# EAGLE design Schematic_01 (EAGLE 7.2.0)
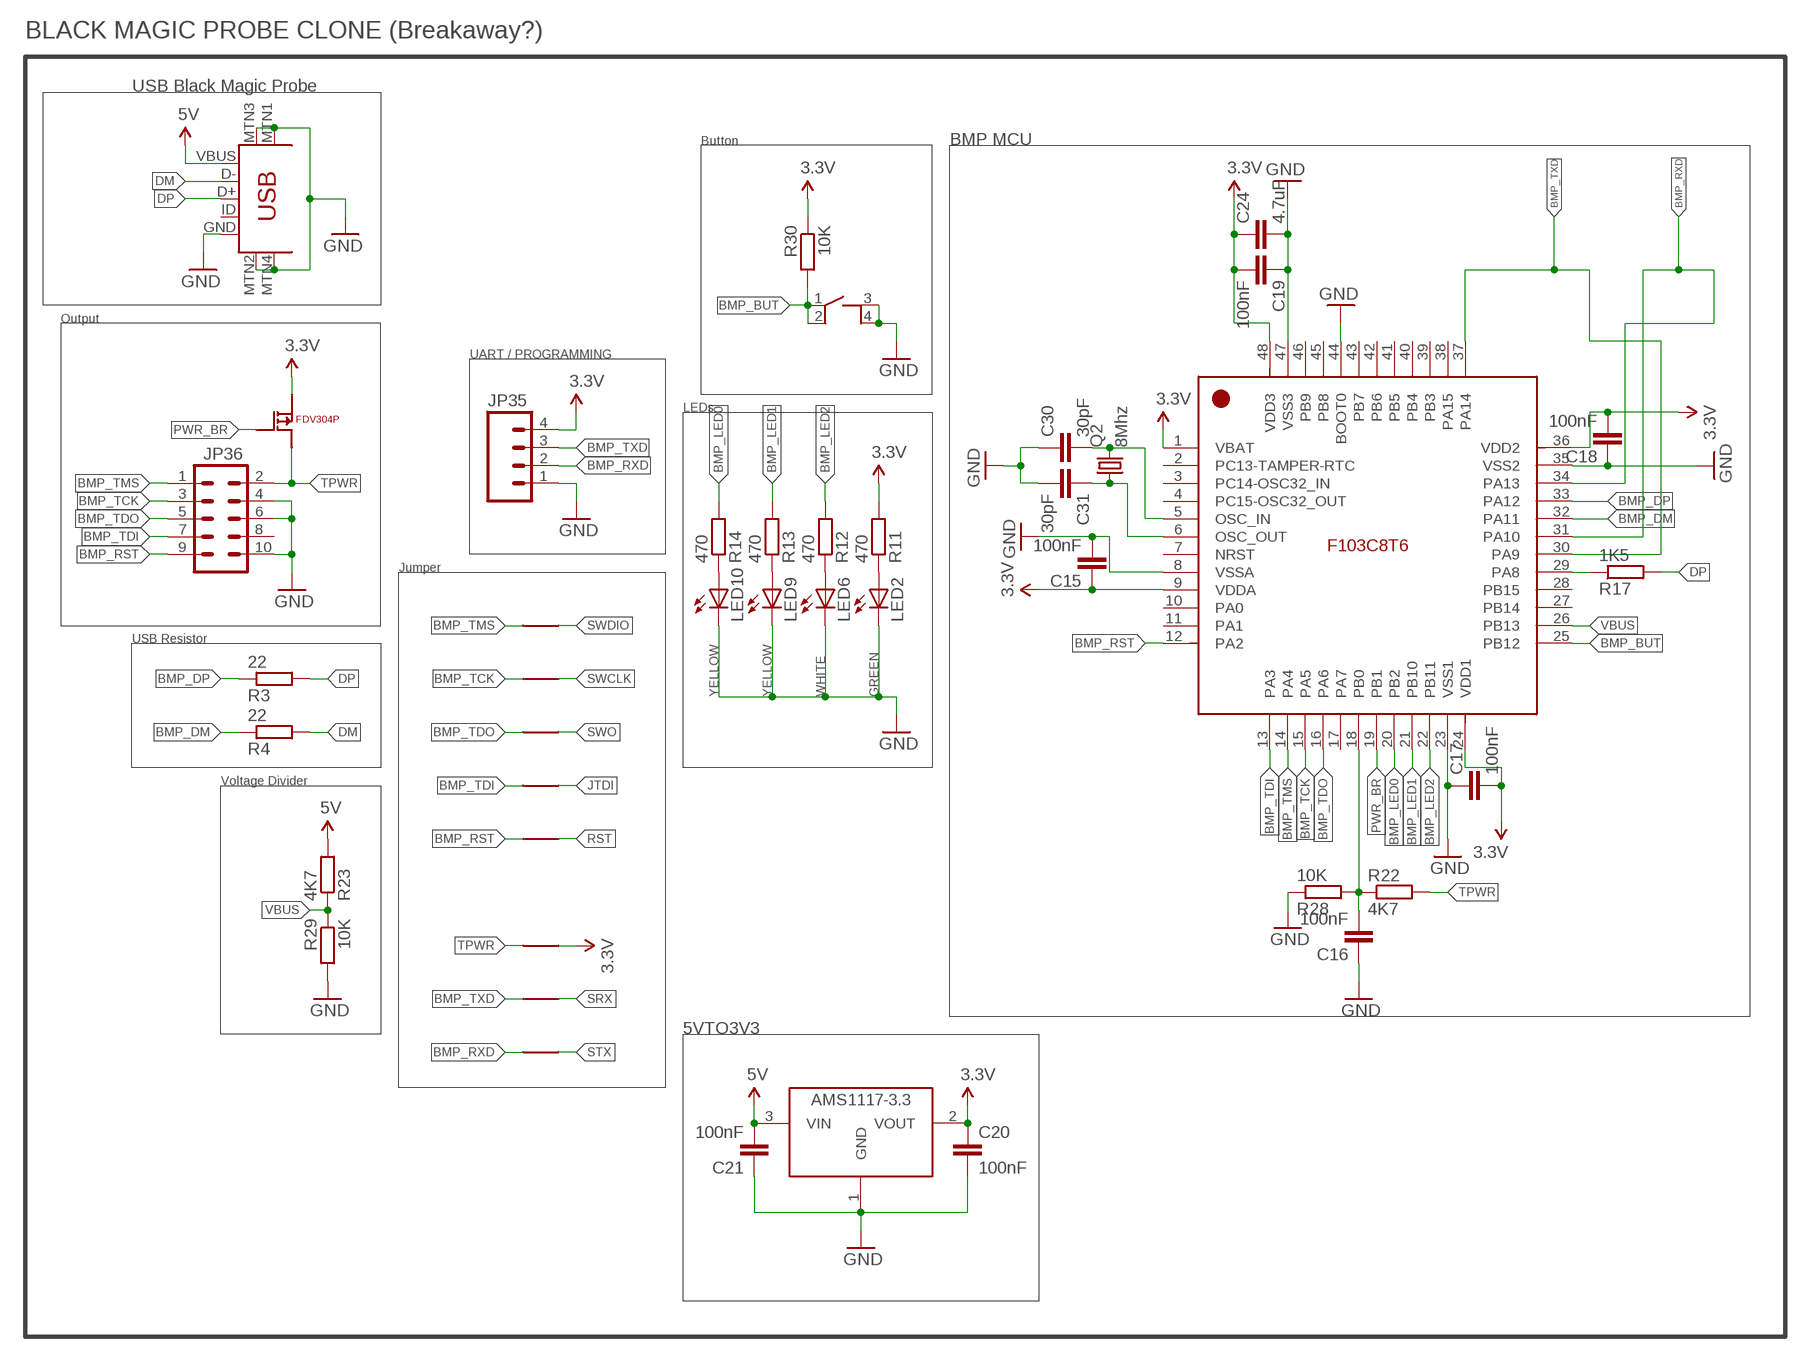
[diagram p0: schematic, sheet 1, part 1 of 2]
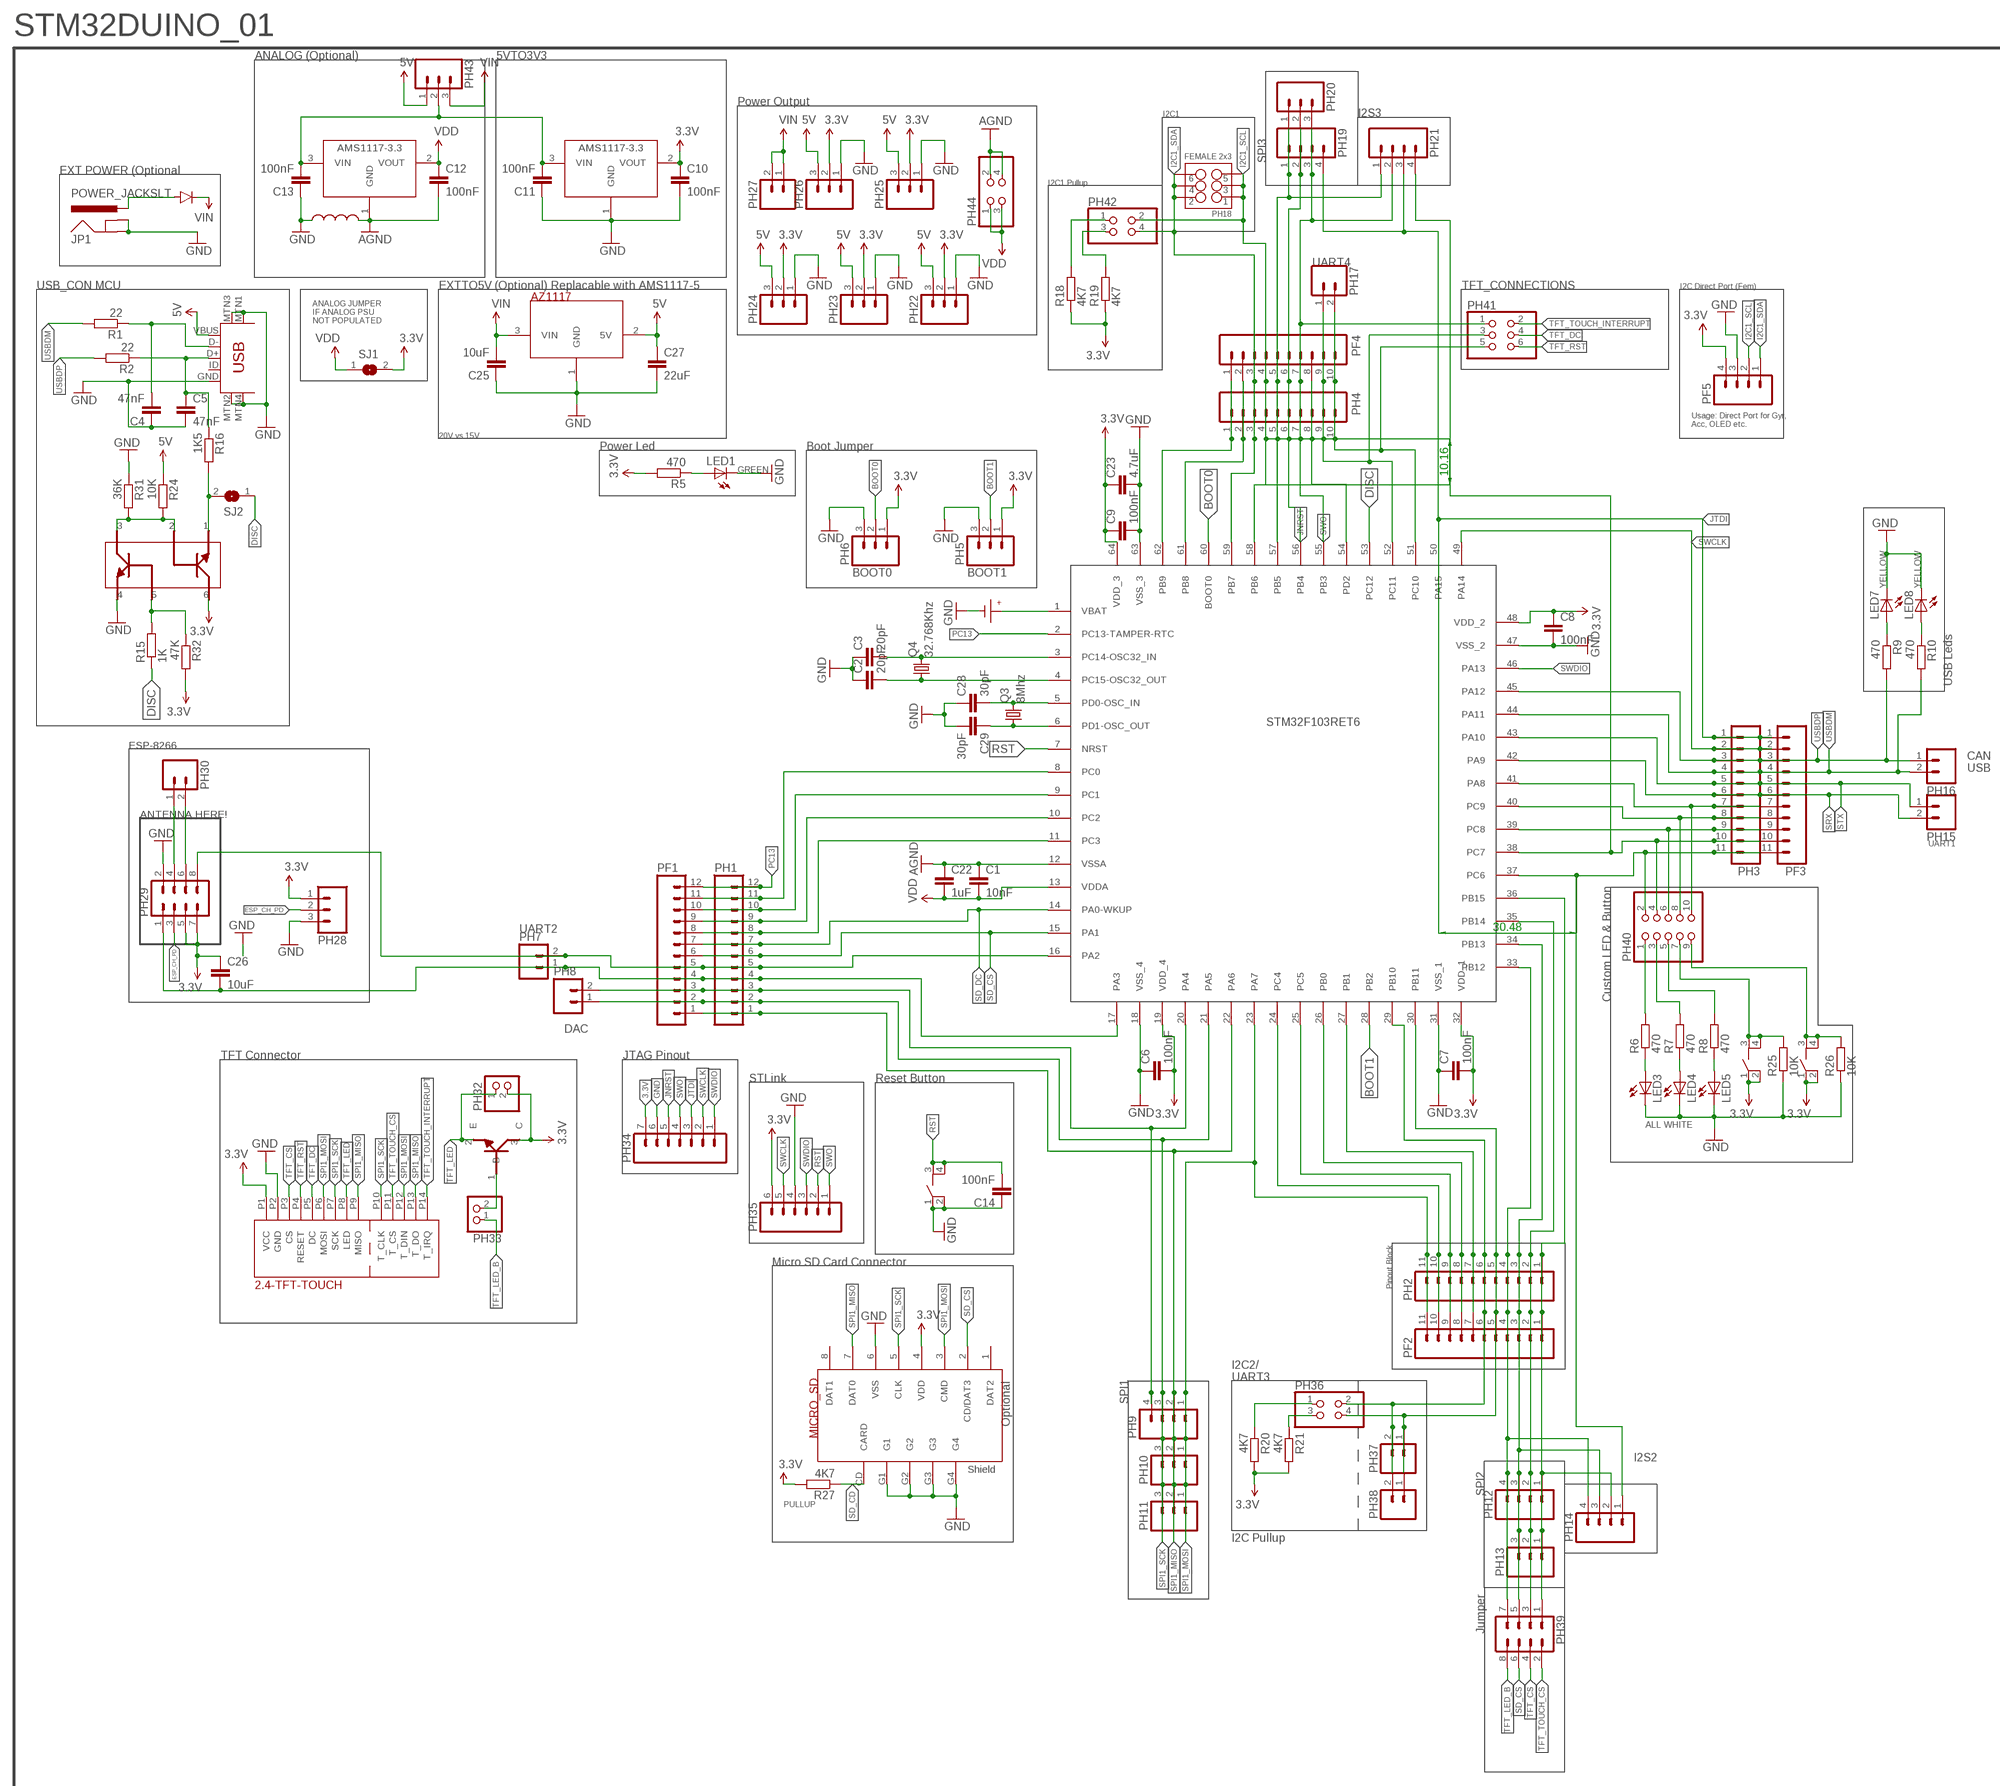
[diagram p1: schematic, sheet 1, part 2 of 2]

## Parts
C1  10nF  C-EUC0805K  [C0805K]
C2  20pF  C-EUC0805K  [C0805K]
C3  20pF  C-EUC0805K  [C0805K]
C4  47nF  C-EUC0805K  [C0805K]
C5  47nF  C-EUC0805K  [C0805K]
C6  100nF  C-EUC0805K  [C0805K]
C7  100nF  C-EUC0805K  [C0805K]
C8  100nF  C-EUC0805K  [C0805K]
C9  100nF  C-EUC0805K  [C0805K]
C10  100nF  C-EUC0805K  [C0805K]
C11  100nF  C-EUC0805K  [C0805K]
C12  100nF  C-EUC0805K  [C0805K]
C13  100nF  C-EUC0805K  [C0805K]
C14  100nF  C-EUC0805K  [C0805K]
C15  100nF  C-EUC0805K  [C0805K]
C16  100nF  C-EUC0805K  [C0805K]
C17  100nF  C-EUC0805K  [C0805K]
C18  100nF  C-EUC0805K  [C0805K]
C19  100nF  C-EUC0805K  [C0805K]
C20  100nF  C-EUC0805K  [C0805K]
C21  100nF  C-EUC0805K  [C0805K]
C22  1uF  C-EUC0805K  [C0805K]
C23  4.7uF  C-EUC0805K  [C0805K]
C24  4.7uF  C-EUC0805K  [C0805K]
C25  10uF  C-EUC0805K  [C0805K]
C26  10uF  C-EUC0805K  [C0805K]
C27  22uF  C-EUC0805K  [C0805K]
C28  30pF  C-EUC0805K  [C0805K]
C29  30pF  C-EUC0805K  [C0805K]
C30  30pF  C-EUC0805K  [C0805K]
C31  30pF  C-EUC0805K  [C0805K]
FB  SMD_FERRITE_BEAD  [0805]
JP1  POWER_JACKSLT  [POWER_JACK_SLOT]
JP35  M04PTH  [1X04]
JP36  M05X2PTH  [AVR_ICSP]
LED1  LEDCHIPLED_0805  [CHIPLED_0805]
LED2  LEDCHIPLED_1206  [CHIPLED_1206]
LED3  LEDCHIPLED_0805  [CHIPLED_0805]
LED4  LEDCHIPLED_0805  [CHIPLED_0805]
LED5  LEDCHIPLED_0805  [CHIPLED_0805]
LED6  LEDCHIPLED_1206  [CHIPLED_1206]
LED7  LEDCHIPLED_0805  [CHIPLED_0805]
LED8  LEDCHIPLED_0805  [CHIPLED_0805]
LED9  LEDCHIPLED_1206  [CHIPLED_1206]
LED10  LEDCHIPLED_1206  [CHIPLED_1206]
PF1  M12PTH  [1X12]
PF2  M11PTH  [1X11]
PF3  M11PTH  [1X11]
PF4  M10SILK_FEMALE_PTH  [1X10]
PF5  M04PTH  [1X04]
PH1  M12PTH  [1X12]
PH2  M11PTH  [1X11]
PH3  M11PTH  [1X11]
PH4  M10SILK_FEMALE_PTH  [1X10]
PH5  M03PTH  [1X03]
PH6  M03PTH  [1X03]
PH7  M02PTH  [1X02]
PH8  M02PTH  [1X02]
PH9  M04PTH  [1X04]
PH10  M03PTH  [1X03]
PH11  M03PTH  [1X03]
PH12  M04PTH  [1X04]
PH13  M03PTH  [1X03]
PH14  M04PTH  [1X04]
PH15  M02PTH  [1X02]
PH16  M02PTH  [1X02]
PH17  M02PTH  [1X02]
PH18  FEMALE 2x3  M03X2FEMALE  [2X3]
PH19  M04PTH  [1X04]
PH20  M03PTH  [1X03]
PH21  M04PTH  [1X04]
PH22  M03PTH  [1X03]
PH23  M03PTH  [1X03]
PH24  M03PTH  [1X03]
PH25  M03PTH  [1X03]
PH26  M03PTH  [1X03]
PH27  M02PTH  [1X02]
PH28  M03PTH  [1X03]
PH29  M04X2  [2X4]
PH30  M02PTH  [1X02]
PH31  TFT-TOUCH  [TFT-TOUCH]
PH32  PINHD-1X2  [1X02]
PH33  PINHD-1X2  [1X02]
PH34  M07  [1X07]
PH35  M06SILK_FEMALE_PTH  [1X06]
PH36  PINHD-2X2  [2X02]
PH37  M02PTH  [1X02]
PH38  M02PTH  [1X02]
PH39  M04X2  [2X4]
PH40  PINHD-2X5  [2X05]
PH41  PINHD-2X3  [2X03]
PH42  PINHD-2X2  [2X02]
PH43  M03PTH  [1X03]
PH44  PINHD-2X2  [2X02]
Q2  8Mhz  CRYSTALSM49  [SM49]
Q3  8Mhz  CRYSTALSM49  [SM49]
Q4  32.768Khz  MC-306  [MC-306]
R1  22  R-EU_R0805  [R0805]
R2  22  R-EU_R0805  [R0805]
R3  22  R-EU_R0805  [R0805]
R4  22  R-EU_R0805  [R0805]
R5  470  R-EU_R0805  [R0805]
R6  470  R-EU_R0805  [R0805]
R7  470  R-EU_R0805  [R0805]
R8  470  R-EU_R0805  [R0805]
R9  470  R-EU_R0805  [R0805]
R10  470  R-EU_R0805  [R0805]
R11  470  R-EU_R0805  [R0805]
R12  470  R-EU_R0805  [R0805]
R13  470  R-EU_R0805  [R0805]
R14  470  R-EU_R0805  [R0805]
R15  1K  R-EU_R0805  [R0805]
R16  1K5  R-EU_R0805  [R0805]
R17  1K5  R-EU_R0805  [R0805]
R18  4K7  R-EU_R0805  [R0805]
R19  4K7  R-EU_R0805  [R0805]
R20  4K7  R-EU_R0805  [R0805]
R21  4K7  R-EU_R0805  [R0805]
R22  4K7  R-EU_R0805  [R0805]
R23  4K7  R-EU_R0805  [R0805]
R24  10K  R-EU_R0805  [R0805]
R25  10K  R-EU_R0805  [R0805]
R26  10K  R-EU_R0805  [R0805]
R27  4K7  R-EU_R0805  [R0805]
R28  10K  R-EU_R0805  [R0805]
R29  10K  R-EU_R0805  [R0805]
R30  10K  R-EU_R0805  [R0805]
R31  36K  R-EU_R0805  [R0805]
R32  47K  R-EU_R0805  [R0805]
SJ1  SJ  [SJ]
SJ2  SJ  [SJ]
U1  STM32F103RET6  [LQFP64_0.5MMPP]
U2  STM32F103C8T6  [LQFP48_7X7MM_0.5MMPP]
U3  AMS1117-3.3  [SOT223]
U4  AMS1117-3.3  [SOT223]
U5  AZ1117-5.0  [SOT223]
U6  AMS1117-3.3  [SOT223]
U7  MBT3904DW1T1G  [SOT236]
U8  BC846A  [SOT23-3]
U9  FDV304P  [SOT23-3]
U$1  BRIDGE  [BRIDGE]
U$2  SMD_BUT_6MM  [SMD_BUT_6MM]
U$4  BRIDGE  [BRIDGE]
U$5  SMD_BUT_6MM  [SMD_BUT_6MM]
U$6  CR2025_BATHOLDER_PTH  [CR2025HOLDER_PTH]
U$7  SD_CARD  [SD_CARD]
U$8  SMD_BUT_6MM  [SMD_BUT_6MM]
U$9  SMD_BUT_6MM  [SMD_BUT_6MM]
U$10  BRIDGE  [BRIDGE]
U$15  BRIDGE  [BRIDGE]
U$16  BRIDGE  [BRIDGE]
U$17  BRIDGE  [BRIDGE]
U$18  BRIDGE  [BRIDGE]
U$19  BRIDGE  [BRIDGE]
U$25  1N4007_SMD  [DO-214AC]
USB1  USB-MINIB-5PIN  [USB-MINIB]
USB2  USB-MINIB-5PIN  [USB-MINIB]

## Nets
3.3V: C6.2 C7.2 C8.1 C9.1 C10.1 C15.1 C17.2 C18.2 C19.2 C20.1 C23.1 C24.1 C26.1 JP35.4 PF5.4 PH5.1 PH6.1 PH22.2 PH23.2 PH24.2 PH25.2 PH26.2 PH28.1 PH29.5 PH29.7 PH31.P1(VCC) PH32.2 PH34.7 PH35.6 R5.2 R11.2 R18.1 R19.1 R20.2 R21.2 R27.2 R30.1 R32.2 SJ1.2 U1.19(VDD_4) U1.32(VDD_1) U1.48(VDD_2) U1.64(VDD_3) U2.1(VBAT) U2.9(VDDA) U2.24(VDD1) U2.36(VDD2) U2.48(VDD3) U3.2(VOUT) U6.2(VOUT) U7.6 U8.3(C) U9.2(S) U$7.4(VDD) U$8.1 U$8.2 U$9.1 U$9.2 U$10.P$2
5V: C21.2 C27.1 PH22.3 PH23.3 PH24.3 PH25.3 PH26.3 PH43.1 R23.2 R24.1 U5.2(5V) U6.3(VIN) USB1.VBUS USB2.VBUS
AGND: C1.1 C12.2 C22.1 FB.P$4 PH44.2 PH44.4 U1.12(VSSA) U4.1(GND)
BMP_BUT: R30.2 U2.25(PB12) U$2.1 U$2.2
BMP_DM: R4.1 U2.32(PA11)
BMP_DP: R3.1 U2.33(PA12)
BMP_LED0: R14.2 U2.20(PB2)
BMP_LED1: R13.2 U2.21(PB10)
BMP_LED2: R12.2 U2.22(PB11)
BMP_RST: JP36.9 U2.12(PA2) U$15.P$1
BMP_RXD: JP35.2 U2.31(PA10) U2.34(PA13) U$1.P$1
BMP_TCK: JP36.3 U2.15(PA5) U$18.P$1
BMP_TDI: JP36.7 U2.13(PA3) U$16.P$1
BMP_TDO: JP36.5 U2.16(PA6) U$17.P$1
BMP_TMS: JP36.1 U2.14(PA4) U$19.P$1
BMP_TXD: JP35.3 U2.30(PA9) U2.37(PA14) U$4.P$1
BOOT0: PH6.2 U1.60(BOOT0)
BOOT1: PH5.2 U1.28(PB2)
DISC: R15.1 SJ2.1 U1.53(PC12)
DM: R4.2 USB2.D-
DP: R3.2 R17.2 USB2.D+
ESP_CH_PD: PH28.2 PH29.3
GND: C2.1 C3.1 C4.1 C5.2 C6.1 C7.1 C8.2 C9.2 C10.2 C11.1 C13.1 C14.1 C15.2 C16.1 C17.1 C18.1 C19.1 C20.2 C21.1 C23.2 C24.2 C25.1 C27.2 C28.1 C29.2 C30.1 C31.2 FB.P$3 JP1.GND@1(GNDBREAK) JP1.GND@2(GND) JP35.1 JP36.4 JP36.6 JP36.10 LED1.C LED2.C LED3.C LED4.C LED5.C LED6.C LED7.C LED8.C LED9.C LED10.C PF5.3 PH5.3 PH6.3 PH22.1 PH23.1 PH24.1 PH25.1 PH26.1 PH28.3 PH29.2 PH31.P2(GND) PH34.6 PH35.4 R25.1 R26.1 R28.1 R29.2 R31.1 U1.18(VSS_4) U1.31(VSS_1) U1.47(VSS_2) U1.63(VSS_3) U2.8(VSSA) U2.23(VSS1) U2.35(VSS2) U2.44(BOOT0) U2.47(VSS3) U3.1(GND) U5.1(GND) U6.1(GND) U7.4 U$2.3 U$2.4 U$5.1 U$5.2 U$6.BATM U$7.6(VSS) U$7.G1 U$7.G2 U$7.G3 U$7.G4 USB1.GND USB1.MTN1(MTN2) USB1.MTN2(MTN3) USB1.MTN3(MTN1) USB1.MTN4 USB2.GND USB2.MTN1(MTN2) USB2.MTN2(MTN3) USB2.MTN3(MTN1) USB2.MTN4
I2C1_SCL: PF4.4 PF5.2 PH4.4 PH18.1 PH18.3 PH18.5 PH42.2 U1.58(PB6)
I2C1_SDA: PF4.3 PF5.1 PH4.3 PH18.2 PH18.4 PH18.6 PH42.4 U1.59(PB7)
JNRST: PF4.6 PH4.6 PH19.2 PH20.2 PH34.5 U1.56(PB4)
JTDI: PF3.1 PH3.1 PH19.4 PH21.3 PH34.3 U1.50(PA15) U$16.P$2
N$1: LED10.A R14.1
N$2: R15.2 R32.1 U7.5
N$3: PF1.11 PH1.11 U1.8(PC0)
N$4: C29.1 Q3.1 U1.6(PD1-OSC_OUT)
N$5: PF4.1 PH4.1 U1.62(PB9)
N$6: C3.2 Q4.4 U1.3(PC14-OSC32_IN)
N$7: PF1.10 PH1.10 U1.9(PC1)
N$8: C2.2 Q4.1 U1.4(PC15-OSC32_OUT)
N$9: C28.2 Q3.2 U1.5(PD0-OSC_IN)
N$10: PF4.2 PH4.2 U1.61(PB8)
N$11: LED7.A R9.1
N$12: LED8.A R10.1
N$13: PF4.5 PH4.5 PH19.1 PH20.1 PH21.1 U1.57(PB5)
N$14: PF2.6 PH2.6 PH36.2 PH37.2 PH38.2 U1.29(PB10)
N$15: PH40.3 R7.2
N$16: PF4.8 PH4.8 U1.54(PD2)
N$18: PH40.5 R8.2
N$19: PH36.1 R20.1
N$21: U1.1(VBAT) U$6.BATP
N$22: PH42.1 R18.2
N$23: PH36.3 R21.1
N$24: PH42.3 R19.2
N$26: PF3.7 PH3.7 PH40.10 U1.41(PA8)
N$27: PF3.8 PH3.8 PH40.8 U1.40(PC9)
N$28: PH33.2 U8.1(B)
N$29: PF3.10 PH3.10 PH21.4 PH40.4 U1.38(PC7)
N$30: PF3.11 PH3.11 PH14.1 PH40.2 U1.37(PC6)
N$31: PF2.5 PH2.5 PH36.4 PH37.1 PH38.1 U1.30(PB11)
N$32: R24.2 R31.2 U7.2 U7.3
N$33: PH29.4 PH30.1
N$34: PH29.6 PH30.2
N$36: LED1.A R5.1
N$37: PF2.7 PH2.7 U1.27(PB1)
N$38: PF2.8 PH2.8 U1.26(PB0)
N$39: PF2.9 PH2.9 U1.25(PC5)
N$40: PF2.10 PH2.10 U1.24(PC4)
N$41: R17.1 U2.29(PA8)
N$42: PF1.9 PH1.9 U1.10(PC2)
N$43: PF1.8 PH1.8 U1.11(PC3)
N$44: R16.2 SJ2.2 U7.1
N$45: C30.2 Q2.2 U2.5(OSC_IN)
N$46: C31.1 Q2.1 U2.6(OSC_OUT)
N$47: C26.2 PF1.4 PH1.4 PH7.1 PH29.1 U1.17(PA3)
N$48: PF1.3 PH1.3 PH8.2 PH9.4 U1.20(PA4)
N$49: LED9.A R13.1
N$50: C16.2 R22.1 R28.2 U2.18(PB0)
N$51: LED6.A R12.1
N$52: LED2.A R11.1
N$53: C11.2 C13.2 PH43.2 U3.3(VIN) U4.3(VIN)
N$54: PF3.9 PH3.9 PH40.6 U1.39(PC8)
N$57: C4.2 R1.1 USB1.D-
N$58: PH40.1 R6.2
N$59: JP1.PWR U$25.ANODE
N$60: LED3.A R6.1
N$61: LED4.A R7.1
N$62: LED5.A R8.1
N$63: C5.1 R2.1 R16.1 USB1.D+
N$65: PH40.9 R26.2 U$9.3 U$9.4
N$66: PH40.7 R25.2 U$8.3 U$8.4
N$100: PF4.10 PH4.10 PH17.2 PH41.5 U1.51(PC10)
N$101: PF4.9 PH4.9 PH17.1 PH41.3 U1.52(PC11)
N$104: PF2.4 PH2.4 PH12.4 PH14.4 PH39.7 U1.33(PB12)
N$105: PF2.3 PH2.3 PH12.3 PH13.3 PH14.3 PH39.5 U1.34(PB13)
N$106: PF2.2 PH2.2 PH12.2 PH13.2 PH39.3 U1.35(PB14)
N$107: PF2.1 PH2.1 PH12.1 PH13.1 PH14.2 PH39.1 U1.36(PB15)
P%1032: PF1.5 PH1.5 PH7.2 PH29.8 U1.16(PA2)
PC13: PF1.12 PH1.12 U1.2(PC13-TAMPER-RTC)
PWR_BR: U2.19(PB1) U9.1(G)
RST: C14.2 PH35.2 U1.7(NRST) U$5.3 U$5.4 U$15.P$2
SD_CD: R27.1 U$7.CD(CARD)
SD_CS: PF1.6 PH1.6 PH39.6 U1.15(PA1) U$7.2(CD/DAT3)
SD_DC: PF1.7 PH1.7 U1.14(PA0-WKUP)
SPI1_MISO: PF1.1 PH1.1 PH9.2 PH10.2 PH11.2 PH31.P9(MISO) PH31.P13(T_DO) U1.22(PA6) U$7.7(DAT0)
SPI1_MOSI: PF2.11 PH2.11 PH9.1 PH10.1 PH11.1 PH31.P6(MOSI) PH31.P12(T_DIN) U1.23(PA7) U$7.3(CMD)
SPI1_SCK: PF1.2 PH1.2 PH8.1 PH9.3 PH10.3 PH11.3 PH31.P7(SCK) PH31.P10(T_CLK) U1.21(PA5) U$7.5(CLK)
SRX: PF3.6 PH3.6 PH15.2 U1.42(PA9) U$4.P$2
STX: PF3.5 PH3.5 PH15.1 U1.43(PA10) U$1.P$2
SWCLK: PF3.2 PH3.2 PH34.2 PH35.5 U1.49(PA14) U$18.P$2
SWDIO: PH34.1 PH35.3 U1.46(PA13) U$19.P$2
SWO: PF4.7 PH4.7 PH19.3 PH20.3 PH21.2 PH34.4 PH35.1 PH41.1 U1.55(PB3) U$17.P$2
TFT_CS: PH31.P3(CS) PH39.4
TFT_DC: PH31.P5(DC) PH41.4
TFT_LED: PH31.P8(LED) PH32.1 U8.2(E)
TFT_LED_B: PH33.1 PH39.8
TFT_RST: PH31.P4(RESET) PH41.6
TFT_TOUCH_CS: PH31.P11(T_CS) PH39.2
TFT_TOUCH_INTERRUPT: PH31.P14(T_IRQ) PH41.2
TPWR: JP36.2 R22.2 U9.3(D) U$10.P$1
USBDM: PF3.4 PH3.4 PH16.2 R1.2 R10.2 U1.44(PA11)
USBDP: PF3.3 PH3.3 PH16.1 R2.2 R9.2 U1.45(PA12)
VBUS: R23.1 R29.1 U2.26(PB13)
VDD: C1.2 C12.1 C22.2 PH44.1 PH44.3 SJ1.1 U1.13(VDDA) U4.2(VOUT)
VIN: C25.2 PH27.1 PH27.2 PH43.3 U5.3(VIN) U$25.CATHODE
Unconnected: JP36.8 U2.2(PC13-TAMPER-RTC) U2.3(PC14-OSC32_IN) U2.4(PC15-OSC32_OUT) U2.7(NRST) U2.10(PA0) U2.11(PA1) U2.17(PA7) U2.27(PB14) U2.28(PB15) U2.38(PA15) U2.39(PB3) U2.40(PB4) U2.41(PB5) U2.42(PB6) U2.43(PB7) U2.45(PB8) U2.46(PB9) U$7.1(DAT2) U$7.8(DAT1) USB1.ID USB2.ID

## Notes on the sheet
- BLACK MAGIC PROBE CLONE (Breakaway?)
- USB Black Magic Probe | STM32DUINO_01
- ANALOG (Optional) | 5VTO3V3
- Button | BMP MCU
- Power Output
- I2C1 | I2S3
- SPI3
- EXT POWER (Optional
- Output | I2C1 Pullup
- UART / PROGRAMMING
- LEDs
- UART4
- USB_CON MCU | EXTTO5V (Optional) Replacable with AMS1117-5 | TFT_CONNECTIONS | I2C Direct Port (Fem)
- ANALOG JUMPER
  IF ANALOG PSU 
  NOT POPULATED
- Jumper
- USB Resistor
- YELLOW | YELLOW | WHITE | GREEN
- Usage: Direct Port for Gyr, 
  Acc, OLED etc.
- 20V vs 15V
- Power Led | Boot Jumper
- GREEN
- Voltage Divider
- BOOT0 | BOOT1
- YELLOW | YELLOW
- USB Leds
- 5VTO3V3
- ESP-8266
- CAN
  USB
- ANTENNA HERE!
- UART1
- UART2
- Custom LED & Button
- DAC
- TFT Connector | JTAG Pinout
- STLink | Reset Button
- ALL WHITE
- Micro SD Card Connector
- Pinout Block
- Optional
- I2C2/
  UART3
- SPI1
- I2S2
- Shield
- SPI2
- PULLUP
- I2C Pullup
- Jumper

## Library data of the parts
C1-C31 = rcl:C-EU: CAPACITOR, European symbol
FB = STMBerry:SMD_FERRITE_BEAD
JP1 = SparkFun-Connectors:POWER_JACK: Power Jack This is the standard 5.5mm barrel jack for power. The PTH is the most common, proven, reliable, footprint. The Slot footprint only works if the mill layer is transmitted to the PCB fab house so be warned. Mating wall wart : TOL-00298 (and others); PROD_ID: PRT-00119
JP35 PF5 PH9 PH12 PH14 PH19 PH21 = SparkFun-Connectors:M04: Header 4 Standard 4-pin 0.1" header. Use with straight break away headers (SKU : PRT-00116), right angle break away headers (PRT-00553), swiss pins (PRT-00743), machine pins (PRT-00117), and female headers (PRT-00115). Molex polarized connector foot print use with SKU : PRT-08231 with associated crimp pins and housings. 1MM SMD Version SKU: PRT-10208
JP36 = SparkFun-Connectors:M05X2: Header 5x2 Standard 10-pin dual row 0.1" header. Commonly used with AVR-ISP. Use with Spark Fun Electronics SKU: PRT-00778
LED1-LED10 = led:LED: LED OSRAM: - CHIPLED LG R971, LG N971, LY N971, LG Q971, LY Q971, LO R971, LY R971 LH N974, LH R974 LS Q976, LO Q976, LY Q976 LO Q996 - Hyper CHIPLED LW Q18S LB Q993, LB Q99A, LB R99A - SideLED LS A670, LO A670, LY A670, LG A670, LP A670 LB A673, LV A673, LT A673, LW A673 LH A674 LY A675 LS A676, LA A676, LO A676, LY A676, LW A676 LS A679, LY A679, LG A679 - Hyper Micro SIDELED® LS Y876, LA Y876, LO Y876, LY Y876 LT Y87S - SmartLED LW L88C, LW L88S LB L89C, LB L89S, LG L890 LS L89K, LO L89K, LY L89K LS L896, LA L896, LO L896, LY L896 - TOPLED LS T670, LO T670, LY T670, LG T670, LP T670 LSG T670, LSP T670, LSY T670, LOP T670, LYG T670 LG T671, LOG T671, LSG T671 LB T673, LV T673, LT T673, LW T673 LH T674 LS T676, LA T676, LO T676, LY T676, LB T676, LH T676, LSB T676, LW T676 LB T67C, LV T67C, LT T67C, LS T67K, LO T67K, LY T67K, LW E67C LS E67B, LA E67B, LO E67B, LY E67B, LB E67C, LV E67C, LT E67C LW T67C LS T679, LY T679, LG T679 LS T770, LO T770, LY T770, LG T770, LP T770 LB T773, LV T773, LT T773, LW T773 LH T774 LS E675, LA E675, LY E675, LS T675 LS T776, LA T776, LO T776, LY T776, LB T776 LHGB T686 LT T68C, LB T68C - Hyper Mini TOPLED® LB M676 - Mini TOPLED Santana® LG M470 LS M47K, LO M47K, LY M47K Source: http://www.osram.convergy.de LUXEON: - LUMILED® LXK2-PW12-R00, LXK2-PW12-S00, LXK2-PW14-U00, LXK2-PW14-V00 LXK2-PM12-R00, LXK2-PM12-S00, LXK2-PM14-U00 LXK2-PE12-Q00, LXK2-PE12-R00, LXK2-PE12-S00, LXK2-PE14-T00, LXK2-PE14-U00 LXK2-PB12-K00, LXK2-PB12-L00, LXK2-PB12-M00, LXK2-PB14-N00, LXK2-PB14-P00, LXK2-PB14-Q00 LXK2-PR12-L00, LXK2-PR12-M00, LXK2-PR14-Q00, LXK2-PR14-R00 LXK2-PD12-Q00, LXK2-PD12-R00, LXK2-PD12-S00 LXK2-PH12-R00, LXK2-PH12-S00 LXK2-PL12-P00, LXK2-PL12-Q00, LXK2-PL12-R00 Source: www.luxeon.com KINGBRIGHT: KA-3528ASYC Source: www.kingbright.com
PF1 PH1 = SparkFun-Connectors:M12: Header 12 Standard 12-pin 0.1" header. Use with straight break away headers (SKU : PRT-00116), right angle break away headers (PRT-00553), swiss pins (PRT-00743), machine pins (PRT-00117), and female headers (PRT-00115).
PF2 PF3 PH2 PH3 = SparkFun-Connectors:M11: Header 11 Standard 11-pin 0.1" header. Use with straight break away headers (SKU : PRT-00116), right angle break away headers (PRT-00553), swiss pins (PRT-00743), machine pins (PRT-00117), and female headers (PRT-00115).
PF4 PH4 = SparkFun-Connectors:M10: Header 10 Standard 10-pin 0.1" header. Use with straight break away headers (SKU : PRT-00116), right angle break away headers (PRT-00553), swiss pins (PRT-00743), machine pins (PRT-00117), and female headers (PRT-00115).; PROD_ID: CONN-11563
PH5 PH6 PH10 PH11 PH13 PH20 PH22-PH26 PH28 PH43 = SparkFun-Connectors:M03: Header 3 Standard 3-pin 0.1" header. Use with straight break away headers (SKU : PRT-00116), right angle break away headers (PRT-00553), swiss pins (PRT-00743), machine pins (PRT-00117), and female headers (PRT-00115). Molex polarized connector foot print use with SKU : PRT-08232 with associated crimp pins and housings.
PH7 PH8 PH15-PH17 PH27 PH30 PH37 PH38 = SparkFun-Connectors:M02: Standard 2-pin 0.1" header. Use with - straight break away headers ( PRT-00116) - right angle break away headers (PRT-00553) - swiss pins (PRT-00743) - machine pins (PRT-00117) - female headers (PRT-00115) Molex polarized connector foot print use with: PRT-08233 with associated crimp pins and housings. 2.54_SCREWTERM for use with PRT-10571. 3.5mm Screw Terminal footprints for PRT-08084 5mm Screw Terminal footprints for use with PRT-08432
PH18 = SparkFun-Connectors:M03X2: 2x3 .1" header. Shrouded, with keying- CONN-10681 SMT- CONN-11415 Pogo pins- HW-11044; PROD_ID: CONN-11566
PH29 PH39 = SparkFun-Connectors:M04X2: .1" header, two rows of four.
PH31 = STMBerry:TFT-TOUCH
PH32 PH33 = pinhead:PINHD-1X2: PIN HEADER
PH34 = SparkFun-Connectors:M07: Header 7 Standard 7-pin 0.1" header. Use with straight break away headers (SKU : PRT-00116), right angle break away headers (PRT-00553), swiss pins (PRT-00743), machine pins (PRT-00117), and female headers (PRT-00115). NOTES ON THE VARIANTS LOCK and LOCK_LONGPADS... This footprint was designed to help hold the alignment of a through-hole component (i.e. 7-pin header) while soldering it into place. You may notice that each hole has been shifted either up or down by 0.005 of an inch from it's more standard position (which is usually a perfectly straight line). This slight alteration caused the pins (the squares in the middle) to touch the edges of the holes. Because they are alternating, it causes a "brace" to hold the header in place. 0.005 has proven to be the perfect amount of "off-center" position when using our standard breakaway headers. Although looks a little odd when you look at the bare footprint, once you have a header in there, the alteration is very hard to notice. Also, if you push a header all the way into place, it is covered up entirely on the bottom side. This idea of altering the position of holes to aid alignment will be further integrated into the Sparkfun Library for other footprints. It can help hold any component with 3 or more connection pins.
PH35 = SparkFun-Connectors:M06: Header 6 Standard 6-pin 0.1" header. Use with straight break away headers (SKU : PRT-00116), right angle break away headers (PRT-00553), swiss pins (PRT-00743), machine pins (PRT-00117), and female headers (PRT-00115). Molex polarized connector foot print use with SKU : PRT-08094 with associated crimp pins and housings. NOTES ON THE VARIANTS LOCK and LOCK_LONGPADS... This footprint was designed to help hold the alignment of a through-hole component (i.e. 6-pin header) while soldering it into place. You may notice that each hole has been shifted either up or down by 0.005 of an inch from it's more standard position (which is a perfectly straight line). This slight alteration caused the pins (the squares in the middle) to touch the edges of the holes. Because they are alternating, it causes a "brace" to hold the component in place. 0.005 has proven to be the perfect amount of "off-center" position when using our standard breakaway headers. Although looks a little odd when you look at the bare footprint, once you have a header in there, the alteration is very hard to notice. Also,if you push a header all the way into place, it is covered up entirely on the bottom side. This idea of altering the position of holes to aid alignment will be further integrated into the Sparkfun Library for other footprints. It can help hold any component with 3 or more connection pins.; PROD_ID: CONN-08437
PH36 PH42 PH44 = pinhead:PINHD-2X2: PIN HEADER
PH40 = pinhead:PINHD-2X5: PIN HEADER
PH41 = pinhead:PINHD-2X3: PIN HEADER
Q2 Q3 = crystal:CRYSTAL: CRYSTAL; OC_FARNELL: unknown; OC_NEWARK: unknown
Q4 = crystal:MC-306: kHz RANGE CRYSTAL UNIT SMD Source: MC-306_405_406_E07X.PDF Homepage <http://www.epsontoyocom.co.jp>; MPN: MC-306 60.0KHZ 100PPM ,12.5PF; OC_FARNELL: 1278040; OC_NEWARK: 31M5576
R1-R32 = rcl:R-EU_: RESISTOR, European symbol
SJ1 SJ2 = jumper:SJ: SMD solder JUMPER
U1 = STMBerry:STM32F103RET6
U2 = STMBerry:STM32F103C8T6
U3 U4 U6 = STMBerry:AMS1117-3.3
U5 = STMBerry:AZ1117-5.0
U7 = STMBerry:MBT3904DW1T1G
U8 = STMBerry:BC846A
U9 = STMBerry:FDV304P
U$1 U$4 U$10 U$15-U$19 = STMBerry:BRIDGE
U$2 U$5 U$8 U$9 = STMBerry:SMD_BUT_6MM
U$6 = STMBerry:CR2025_BATHOLDER_PTH
U$7 = STMBerry:SD_CARD
U$25 = STMBerry:1N4007_SMD
USB1 USB2 = SparkFun-Connectors:USB-MINIB: Mini-USB "B" connector with 5th pin broken out. Created new symbol breaking out 5th "ID" pin in mini/micro USB connector spec. See: http://en.wikipedia.org/wiki/Mini_usb#Cables. Uses same footprint as 4-pin symbol. Also added pins to connect to mounting / shield pads if required (probably not generally needed as signals aren't shielded once they leave the connector).

## Board
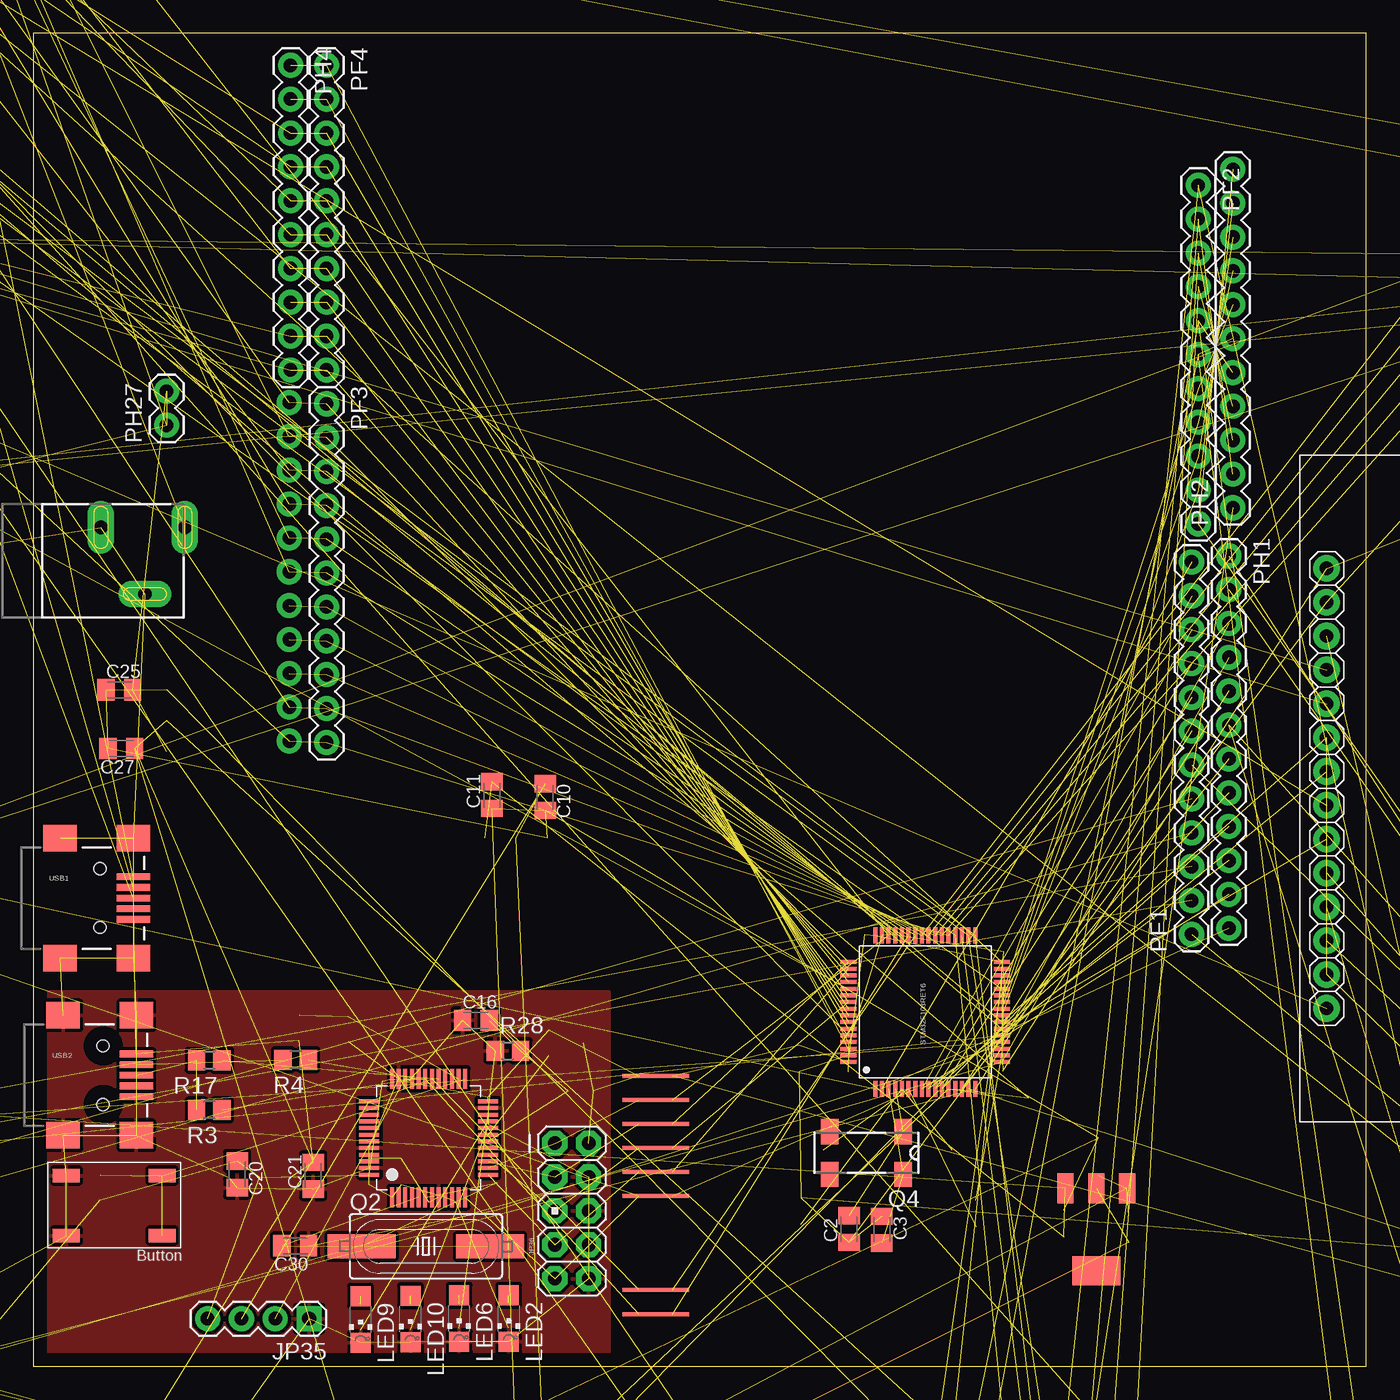
[diagram p2: board, top side]
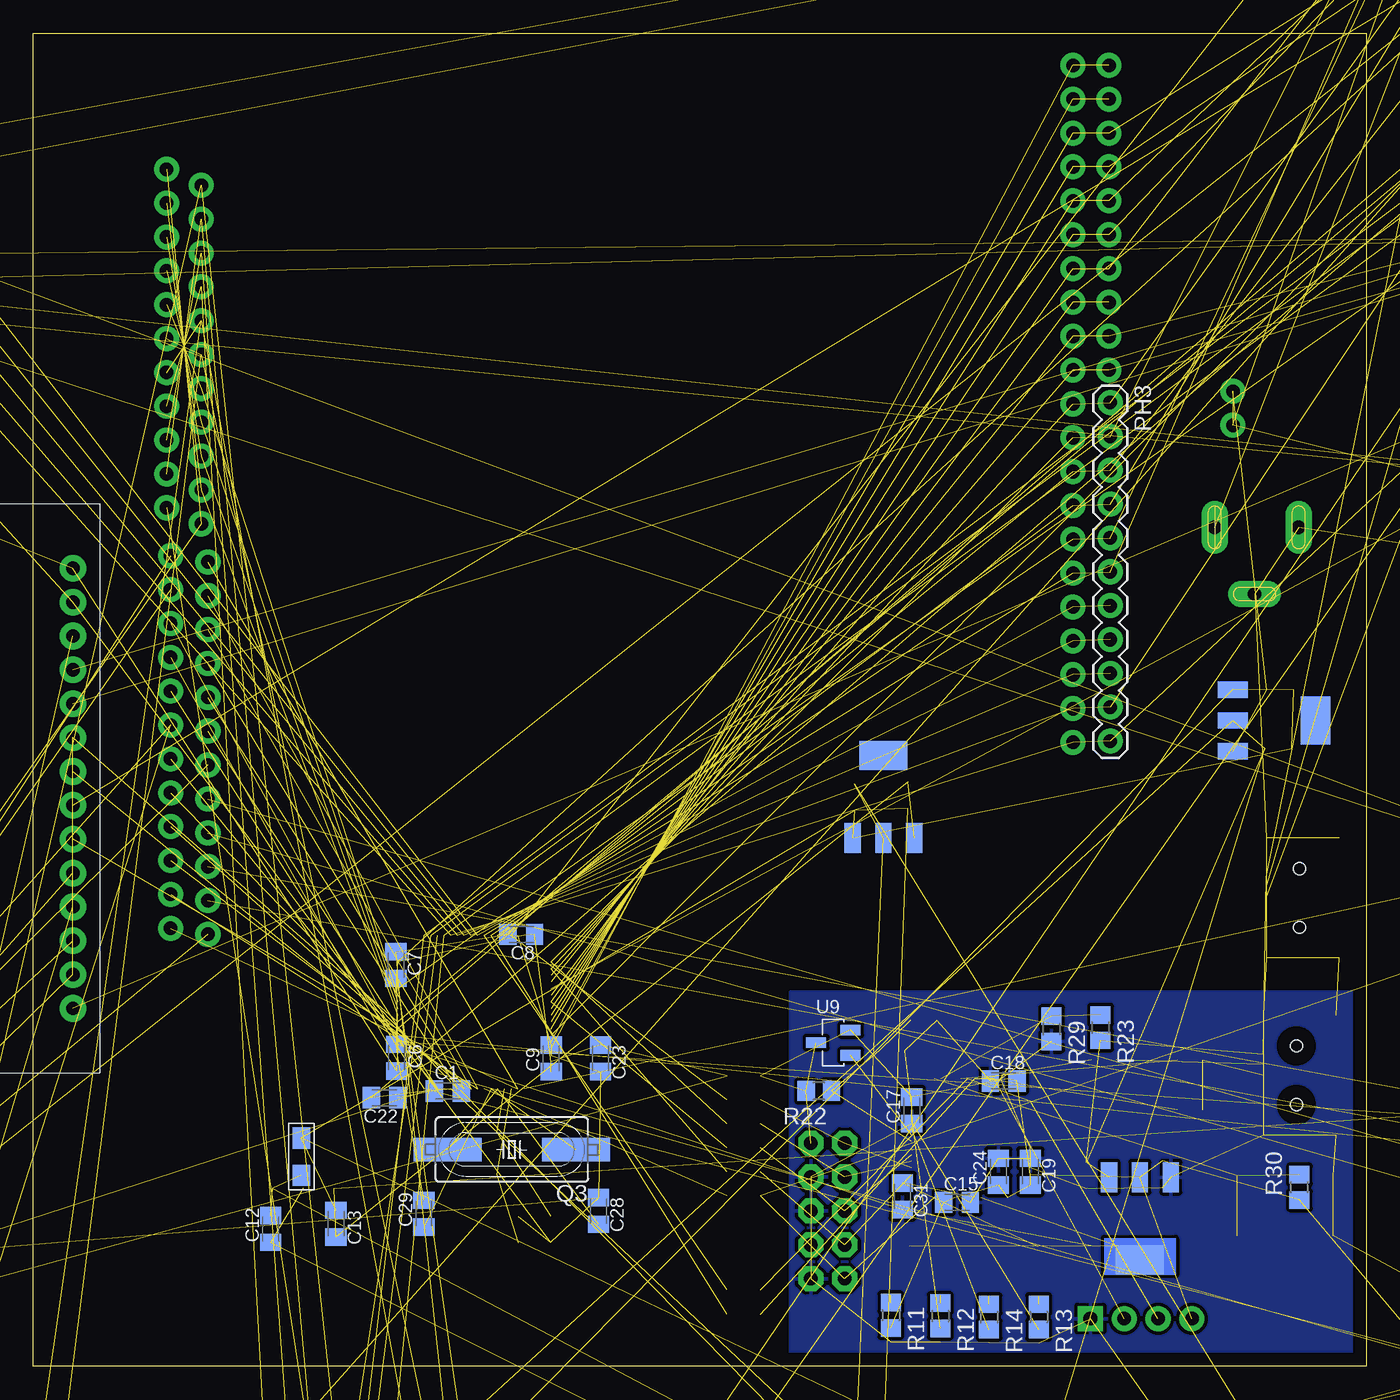
[diagram p3: board, bottom side, seen from below]

Size 100 x 100 mm. Coordinates in mm from the lower left corner, seen from the top.
Outline: 0,0 100,0 100,100 0,100 0,0
Copper layers (1*16): Top 0.035mm / dielectric 1.5mm / Bottom 0.035mm
Design rules "default": minimum track width 10mil, minimum drill 24mil, track to track 8mil, track to pad 8mil, pad to pad 8mil, via to via 8mil, smd to smd 8mil, copper to edge 40mil, drill to drill 8mil, minimum pad ring 10mil, minimum via ring 8mil, stop-mask expansion 4mil, vias tented up to drill 0mil, thermal gap 10mil

### Footprints (pad centres in the part's own frame; a part is rotated, then mirrored left to right if it is on the bottom)
C0805K = smd 1.3 x 1.6: 1 -1,0; 2 1,0
0805 = smd 1.3 x 1.6: P$3 0,1.52; P$4 0,-1.28
POWER_JACK_SLOT = drill 1 pad 2 long: GND@1 2.58,7.5; GND@2 7.58,10.8; PWR 2.58,13.8
1X04 = drill 1.016 pad 1.88 square: 1 0,0 | drill 1.016 pad 1.88: 2 2.54,0; 3 5.08,0; 4 7.62,0
AVR_ICSP = drill 1.016 pad 1.88 octagon: 1 -1.27,5.08; 2 1.27,5.08; 3 -1.27,2.54; 4 1.27,2.54; 5 -1.27,0; 6 1.27,0; 7 -1.27,-2.54; 8 1.27,-2.54; 9 -1.27,-5.08; 10 1.27,-5.08
CHIPLED_0805 = smd 1.2 x 1.2: A 0,-1.05; C 0,1.05
CHIPLED_1206 = smd 1.5 x 1.5: A 0,-1.75; C 0,1.75
1X12 = drill 1.016 pad 1.88: 1 0,0; 2 2.54,0; 3 5.08,0; 4 7.62,0; 5 10.16,0; 6 12.7,0; 7 15.24,0; 8 17.78,0; 9 20.32,0; 10 22.86,0; 11 25.4,0; 12 27.94,0
1X11 = drill 1.016 pad 1.88: 1 0,0; 2 2.54,0; 3 5.08,0; 4 7.62,0; 5 10.16,0; 6 12.7,0; 7 15.24,0; 8 17.78,0; 9 20.32,0; 10 22.86,0; 11 25.4,0
1X10 = drill 1.016 pad 1.88: 1 0,0; 2 2.54,0; 3 5.08,0; 4 7.62,0; 5 10.16,0; 6 12.7,0; 7 15.24,0; 8 17.78,0; 9 20.32,0; 10 22.86,0
1X03 = drill 1.016 pad 1.88: 1 0,0; 2 2.54,0; 3 5.08,0
1X02 = drill 1.016 pad 1.88: 1 0,0; 2 2.54,0
2X3 = drill 1.016 pad 1.88 octagon: 1 0,0; 2 0,2.54; 3 2.54,0; 4 2.54,2.54; 5 5.08,0; 6 5.08,2.54
2X4 = drill 1.016 pad 1.88 octagon: 1 -3.81,-1.27; 2 -3.81,1.27; 3 -1.27,-1.27; 4 -1.27,1.27; 5 1.27,-1.27; 6 1.27,1.27; 7 3.81,-1.27; 8 3.81,1.27
TFT-TOUCH = drill 1 pad 2: P1 -16.51,-41; P2 -13.97,-41; P3 -11.43,-41; P4 -8.89,-41; P5 -6.35,-41; P6 -3.81,-41; P7 -1.27,-41; P8 1.27,-41; P9 3.81,-41; P10 6.35,-41; P11 8.89,-41; P12 11.43,-41; P13 13.97,-41; P14 16.51,-41; P15 -3.81,32.18; P16 -1.27,32.18; P17 1.27,32.18; P18 3.81,32.18; P20 3.82,40.005; P21 1.28,40.005; P22 -1.26,40.005; P23 -3.8,40.005
1X02' = drill 1.016 long: 1 -1.27,0; 2 1.27,0
1X07 = drill 1.016 pad 1.88: 1 0,0; 2 2.54,0; 3 5.08,0; 4 7.62,0; 5 10.16,0; 6 12.7,0; 7 15.24,0
1X06 = drill 1.016 pad 1.88: 1 0,0; 2 2.54,0; 3 5.08,0; 4 7.62,0; 5 10.16,0; 6 12.7,0
2X02 = drill 1.016 octagon: 1 -1.27,-1.27; 2 -1.27,1.27; 3 1.27,-1.27; 4 1.27,1.27
2X05 = drill 1.016 octagon: 1 -5.08,-1.27; 2 -5.08,1.27; 3 -2.54,-1.27; 4 -2.54,1.27; 5 0,-1.27; 6 0,1.27; 7 2.54,-1.27; 8 2.54,1.27; 9 5.08,-1.27; 10 5.08,1.27
2X03 = drill 1.016 octagon: 1 -2.54,-1.27; 2 -2.54,1.27; 3 0,-1.27; 4 0,1.27; 5 2.54,-1.27; 6 2.54,1.27
SM49 = smd 5.08 x 1.778: 1 -4.826,0; 2 4.826,0
MC-306 = smd 1.3 x 1.9: 1 -2.75,-1.6; 2 2.75,-1.6; 3 2.75,1.6; 4 -2.75,1.6
R0805 = smd 1.3 x 1.5: 1 -0.95,0; 2 0.95,0
SJ = smd 1.168 x 1.6: 1 -0.762,0; 2 0.762,0
LQFP64_0.5MMPP = smd 1.2 x 0.3: 1 -5.25,3.25; 2 -5.25,2.75; 3 -5.25,2.25; 4 -5.25,1.75; 5 -5.25,1.25; 6 -5.25,0.75; 7 -5.25,0.25; 8 -5.25,-0.25; 9 -5.25,-0.75; 10 -5.25,-1.25; 11 -5.25,-1.75; 12 -5.25,-2.25; 13 -5.25,-2.75; 14 -5.25,-3.25; 15 -5.25,-3.75; 16 -5.25,-4.25; 33 6.25,-4.25; 34 6.25,-3.75; 35 6.25,-3.25; 36 6.25,-2.75; 37 6.25,-2.25; 38 6.25,-1.75; 39 6.25,-1.25; 40 6.25,-0.75; 41 6.25,-0.25; 42 6.25,0.25; 43 6.25,0.75; 44 6.25,1.25; 45 6.25,1.75; 46 6.25,2.25; 47 6.25,2.75; 48 6.25,3.25 | smd 0.3 x 1.2: 17 -3.25,-6.25; 18 -2.75,-6.25; 19 -2.25,-6.25; 20 -1.75,-6.25; 21 -1.25,-6.25; 22 -0.75,-6.25; 23 -0.25,-6.25; 24 0.25,-6.25; 25 0.75,-6.25; 26 1.25,-6.25; 27 1.75,-6.25; 28 2.25,-6.25; 29 2.75,-6.25; 30 3.25,-6.25; 31 3.75,-6.25; 32 4.25,-6.25; 49 4.25,5.25; 50 3.75,5.25; 51 3.25,5.25; 52 2.75,5.25; 53 2.25,5.25; 54 1.75,5.25; 55 1.25,5.25; 56 0.75,5.25; 57 0.25,5.25; 58 -0.25,5.25; 59 -0.75,5.25; 60 -1.25,5.25; 61 -1.75,5.25; 62 -2.25,5.25; 63 -2.75,5.25; 64 -3.25,5.25
LQFP48_7X7MM_0.5MMPP = smd 1.5 x 0.3: 1 -4.45,2.75; 2 -4.45,2.25; 3 -4.45,1.75; 4 -4.45,1.25; 5 -4.45,0.75; 6 -4.45,0.25; 7 -4.45,-0.25; 8 -4.45,-0.75; 9 -4.45,-1.25; 10 -4.45,-1.75; 11 -4.45,-2.25; 12 -4.45,-2.75; 25 4.45,-2.75; 26 4.45,-2.25; 27 4.45,-1.75; 28 4.45,-1.25; 29 4.45,-0.75; 30 4.45,-0.25; 31 4.45,0.25; 32 4.45,0.75; 33 4.45,1.25; 34 4.45,1.75; 35 4.45,2.25; 36 4.45,2.75 | smd 0.3 x 1.5: 13 -2.75,-4.45; 14 -2.25,-4.45; 15 -1.75,-4.45; 16 -1.25,-4.45; 17 -0.75,-4.45; 18 -0.25,-4.45; 19 0.25,-4.45; 20 0.75,-4.45; 21 1.25,-4.45; 22 1.75,-4.45; 23 2.25,-4.45; 24 2.75,-4.45; 37 2.75,4.45; 38 2.25,4.45; 39 1.75,4.45; 40 1.25,4.45; 41 0.75,4.45; 42 0.25,4.45; 43 -0.25,4.45; 44 -0.75,4.45; 45 -1.25,4.45; 46 -1.75,4.45; 47 -2.25,4.45; 48 -2.75,4.45
SOT223 = smd 2.235 x 1.219: 1 -3.099,2.311; 2 -3.099,0; 3 -3.099,-2.311 | smd 2.2 x 3.6: 4 3.099,0
SOT236 = smd 0.3 x 1: 1 -0.66,-1.09; 2 0,-1.09; 3 0.66,-1.09; 4 0.66,1.09; 5 0,1.09; 6 -0.66,1.09
SOT23-3 = smd 0.8 x 1.5: 1 -0.6,-1.35; 2 1.3,-1.35; 3 0.35,1.25
BRIDGE = smd 2.5 x 0.3: P$1 -1.25,0; P$2 1.25,0
SMD_BUT_6MM = smd 2 x 1: 1 -1.9,3.9; 2 -1.9,-0.6; 3 5.3,3.9; 4 5.3,-0.6
CR2025HOLDER_PTH = drill 1.4 pad 1.676 long: BATM -7.2,-5.1; BATP 12.8,-5.1
SD_CARD = smd 0.7 x 1.6: 1 0,0; 2 -1.1,0; 3 -2.2,0; 4 -3.3,0; 5 -4.4,0; 6 -5.5,0; 7 -6.6,0; 8 -7.7,0; CD -8.8,0 | smd 1.2 x 1.4: G1 -10,-0.5 | smd 1.2 x 2.2: G2 -10,-10.1; G4 5.5,-10.1 | smd 1.6 x 1.4: G3 4.6,-0.5 | hole 1.5: -7.25,-10.5; 0.8,-10.5
DO-214AC = smd 1.5 x 1.7: ANODE -2.6,0; CATHODE 2.6,0
USB-MINIB = smd 2.5 x 0.5: D+ 2.5,0; D- 2.5,0.8; GND 2.5,-1.6; ID 2.5,-0.8; VBUS 2.5,1.6 | smd 2.5 x 2: MTN1 -3,4.5; MTN2 2.5,4.5; MTN3 -3,-4.5; MTN4 2.5,-4.5 | hole 0.9: 0,2.2; 0,-2.2

### Placement (x,y rotation side)
C1  68.9,20.65 0 bottom
C2  61.2,10.3 90 top
C3  63.65,10.25 270 top
C4  -145.95,125.05 0 top  (outside the outline)
C5  -145.95,120.35 0 top  (outside the outline)
C6  72.75,23.15 270 bottom
C7  72.8,30.1 270 bottom
C8  63.4,32.4 180 bottom
C9  61.15,23.1 90 bottom
C10  38.4,42.7 270 top
C11  34.4,42.85 90 top
C12  82.2,10.3 90 bottom
C13  77.3,10.7 270 bottom
C14  -145.95,87.45 0 top  (outside the outline)
C15  30.7,12.3 0 bottom
C16  33.2,25.95 0 top
C17  34.1,19.2 90 bottom
C18  27.2,21.4 0 bottom
C19  25.2,14.6 270 bottom
C20  15.3,14.4 270 top
C21  21,14.3 90 top
C22  73.65,20.15 180 bottom
C23  57.45,23.1 270 bottom
C24  27.6,14.6 90 bottom
C25  6.45,50.75 0 top
C26  -145.95,115.65 0 top  (outside the outline)
C27  6.6,46.35 180 top
C28  57.6,11.65 270 bottom
C29  70.7,11.45 90 bottom
C30  19.65,9.05 180 top
C31  34.8,12.75 270 bottom
FB  79.9,15.6 0 bottom
JP1  -2.43,65.51 270 top
JP35  20.69,3.56 180 top
JP36  40.4,11.65 0 top
LED1  -12.19,128.52 0 top  (outside the outline)
LED2  35.67,3.59 180 top
LED3  129.86,81.92 0 top  (outside the outline)
LED4  125.22,82.2 0 top  (outside the outline)
LED5  120.69,82.35 0 top  (outside the outline)
LED6  31.95,3.58 180 top
LED7  -123.19,120.65 0 top  (outside the outline)
LED8  -118.11,120.65 0 top  (outside the outline)
LED9  24.55,3.5 180 top
LED10  28.3,3.53 180 top
PF1  86.9,32.4 90 top
PF2  87.4,88.6 270 top
PF3  22,72.2 270 top
PF4  22,97.6 270 top
PF5  -62.23,143.51 0 top  (outside the outline)
PH1  89.7,60.8 270 top
PH2  90,64.4 90 top
PH3  19.2,72.3 270 bottom
PH4  19.3,97.6 270 top
PH5  -100.33,148.59 0 top  (outside the outline)
PH6  -64.77,148.59 0 top  (outside the outline)
PH7  -31.9,5.7 90 top  (outside the outline)
PH8  -19.3,15.2 90 top  (outside the outline)
PH9  -107.95,143.51 0 top  (outside the outline)
PH10  -73.66,148.59 0 top  (outside the outline)
PH11  -82.55,148.59 0 top  (outside the outline)
PH12  72.7,-48.6 0 top  (outside the outline)
PH13  76.6,-42.6 0 top  (outside the outline)
PH14  -85.09,143.51 0 top  (outside the outline)
PH15  -24.13,153.67 0 top  (outside the outline)
PH16  -30.48,153.67 0 top  (outside the outline)
PH17  -113.03,148.59 0 top  (outside the outline)
PH18  -100.08,76.71 0 top  (outside the outline)
PH19  -39.37,143.51 0 top  (outside the outline)
PH20  -46.99,148.59 0 top  (outside the outline)
PH21  -50.8,143.51 0 top  (outside the outline)
PH22  -38.1,148.59 0 top  (outside the outline)
PH23  -29.21,148.59 0 top  (outside the outline)
PH24  -20.32,148.59 0 top  (outside the outline)
PH25  38.7,-71.7 0 top  (outside the outline)
PH26  83.3,-23.4 90 top  (outside the outline)
PH27  10,70.6 90 top
PH28  0,-18.5 0 top  (outside the outline)
PH29  -11.2,-1 0 top  (outside the outline)
PH30  70.5,-19.5 270 top  (outside the outline)
PH31  138.03,43.35 270 top
PH32  [1X02']  -41.91,127 0 top  (outside the outline)
PH33  [1X02']  -35.56,127 0 top  (outside the outline)
PH34  -113.03,138.43 0 top  (outside the outline)
PH35  -27.94,143.51 0 top  (outside the outline)
PH36  104.2,-84.8 270 top  (outside the outline)
PH37  64.8,-43.9 180 top  (outside the outline)
PH38  106.4,-53.7 180 top  (outside the outline)
PH39  118.5,-45.1 270 top  (outside the outline)
PH40  113.34,85.91 90 top  (outside the outline)
PH41  -87.63,105.41 0 top  (outside the outline)
PH42  -96.01,94.49 0 top  (outside the outline)
PH43  -163.15,32.1 270 top  (outside the outline)
PH44  28.7,-16.8 0 top  (outside the outline)
Q2  29.45,9 0 top
Q3  64.1,16.25 180 bottom
Q4  62.5,16 180 top
R1  -16.51,121.92 0 top  (outside the outline)
R2  -23.46,120.37 0 top  (outside the outline)
R3  13.21,19.22 180 top
R4  19.69,22.99 180 top
R5  -76.2,121.92 0 top  (outside the outline)
R6  -62.38,61.52 0 top  (outside the outline)
R7  -17.06,84.67 0 top  (outside the outline)
R8  -35.09,30.23 0 top  (outside the outline)
R9  -66.04,121.92 0 top  (outside the outline)
R10  -71.12,121.92 0 top  (outside the outline)
R11  35.67,3.82 270 bottom
R12  31.94,3.78 270 bottom
R13  24.57,3.69 270 bottom
R14  28.3,3.7 270 bottom
R15  -99.06,115.57 0 top  (outside the outline)
R16  -124.46,115.57 0 top  (outside the outline)
R17  13.21,22.96 180 top
R18  -54.61,121.92 0 top  (outside the outline)
R19  -48.26,121.92 0 top  (outside the outline)
R20  -35.56,121.92 0 top  (outside the outline)
R21  -41.91,121.92 0 top  (outside the outline)
R22  41.07,20.65 180 bottom
R23  19.93,25.39 270 bottom
R24  -118.11,115.57 0 top  (outside the outline)
R25  -60.96,121.92 0 top  (outside the outline)
R26  -16.76,114.81 0 top  (outside the outline)
R27  -29.21,121.92 0 top  (outside the outline)
R28  35.61,23.66 0 top
R29  23.6,25.3 270 bottom
R30  5.01,13.42 90 bottom
R31  -111.76,115.57 0 top  (outside the outline)
R32  -105.41,115.57 0 top  (outside the outline)
SJ1  -80.01,153.67 0 top  (outside the outline)
SJ2  -120.65,153.67 0 top  (outside the outline)
U1  66.42,26.07 90 top
U2  29.66,17.12 90 top
U3  36.22,42.72 90 bottom
U4  79.75,10.25 270 top
U5  6.9,48.44 0 bottom
U6  16.98,11.08 270 bottom
U7  -124.46,154.94 0 top  (outside the outline)
U8  -48.26,154.94 0 top  (outside the outline)
U9  40.03,23.92 90 bottom
U$1  46.7,3.9 180 top
U$2  7.77,13.7 180 top
U$4  46.7,5.75 180 top
U$5  -49.45,49.64 270 top  (outside the outline)
U$6  -25.48,51.79 270 bottom  (outside the outline)
U$7  131.95,1.9 90 top  (outside the outline)
U$8  142.49,78.38 90 top  (outside the outline)
U$9  145.24,95.9 90 top  (outside the outline)
U$10  46.7,21.8 180 top
U$15  46.7,12.8 180 top
U$16  46.7,14.6 180 top
U$17  46.7,16.4 180 top
U$18  46.7,18.2 180 top
U$19  46.7,20 180 top
U$25  -25.4,163.83 0 top  (outside the outline)
USB1  5.01,35.12 0 top
USB2  5.23,21.83 0 top

### Tracks (layer width: path | path; a pad name or v marks a point on that pad's centre or on a via)
3.3V  (58 unrouted)
5V  (13 unrouted)
AGND  (7 unrouted)
BMP_BUT  (3 unrouted)
BMP_DM  (1 unrouted)
BMP_DP  (1 unrouted)
BMP_LED0  (1 unrouted)
BMP_LED1  (1 unrouted)
BMP_LED2  (1 unrouted)
BMP_RST  (2 unrouted)
BMP_RXD  (3 unrouted)
BMP_TCK  (2 unrouted)
BMP_TDI  (2 unrouted)
BMP_TDO  (2 unrouted)
BMP_TMS  (2 unrouted)
BMP_TXD  (3 unrouted)
BOOT0  (1 unrouted)
BOOT1  (1 unrouted)
DISC  (2 unrouted)
DM  (1 unrouted)
DP  (2 unrouted)
ESP_CH_PD  (1 unrouted)
GND  (94 unrouted)
  pour Bottom (isolate 0.254): -0.1,28.1 43.2,28.1 43.2,0.1 -0.1,0.1
  pour Top (isolate 0.254): -0.1,28.1 43.2,28.1 43.2,0.1 -0.1,0.1
I2C1_SCL  (7 unrouted)
I2C1_SDA  (7 unrouted)
JNRST  (5 unrouted)
JTDI  (6 unrouted)
N$1  (1 unrouted)
N$2  (2 unrouted)
N$3  (2 unrouted)
N$4  (2 unrouted)
N$5  (2 unrouted)
N$6  (2 unrouted)
N$7  (2 unrouted)
N$8  (2 unrouted)
N$9  (2 unrouted)
N$10  (2 unrouted)
N$11  (1 unrouted)
N$12  (1 unrouted)
N$13  (5 unrouted)
N$14  (5 unrouted)
N$15  (1 unrouted)
N$16  (2 unrouted)
N$18  (1 unrouted)
N$19  (1 unrouted)
N$21  (1 unrouted)
N$22  (1 unrouted)
N$23  (1 unrouted)
N$24  (1 unrouted)
N$26  (3 unrouted)
N$27  (3 unrouted)
N$28  (1 unrouted)
N$29  (4 unrouted)
N$30  (4 unrouted)
N$31  (5 unrouted)
N$32  (3 unrouted)
N$33  (1 unrouted)
N$34  (1 unrouted)
N$36  (1 unrouted)
N$37  (2 unrouted)
N$38  (2 unrouted)
N$39  (2 unrouted)
N$40  (2 unrouted)
N$41  (1 unrouted)
N$42  (2 unrouted)
N$43  (2 unrouted)
N$44  (2 unrouted)
N$45  (2 unrouted)
N$46  (2 unrouted)
N$47  (5 unrouted)
N$48  (4 unrouted)
N$49  (1 unrouted)
N$50  (3 unrouted)
N$51  (1 unrouted)
N$52  (1 unrouted)
N$53  (4 unrouted)
N$54  (3 unrouted)
N$57  (2 unrouted)
N$58  (1 unrouted)
N$59  (1 unrouted)
N$60  (1 unrouted)
N$61  (1 unrouted)
N$62  (1 unrouted)
N$63  (3 unrouted)
N$65  (3 unrouted)
N$66  (3 unrouted)
N$100  (4 unrouted)
N$101  (4 unrouted)
N$104  (5 unrouted)
N$105  (6 unrouted)
N$106  (5 unrouted)
N$107  (6 unrouted)
P%1032  (4 unrouted)
PC13  (2 unrouted)
PWR_BR  (1 unrouted)
RST  (5 unrouted)
SD_CD  (1 unrouted)
SD_CS  (4 unrouted)
SD_DC  (2 unrouted)
SPI1_MISO  (8 unrouted)
SPI1_MOSI  (8 unrouted)
SPI1_SCK  (9 unrouted)
SRX  (4 unrouted)
STX  (4 unrouted)
SWCLK  (5 unrouted)
SWDIO  (3 unrouted)
SWO  (9 unrouted)
TFT_CS  (1 unrouted)
TFT_DC  (1 unrouted)
TFT_LED  (2 unrouted)
TFT_LED_B  (1 unrouted)
TFT_RST  (1 unrouted)
TFT_TOUCH_CS  (1 unrouted)
TFT_TOUCH_INTERRUPT  (1 unrouted)
TPWR  (3 unrouted)
USBDM  (5 unrouted)
USBDP  (5 unrouted)
VBUS  (2 unrouted)
VDD  (7 unrouted)
VIN  (5 unrouted)
(copper drawn outside any net)
  shapes: Bottom area x1